# Altium schematic sheet SCH_DONGHO.SchDoc
size A3; SheetNumber: 5; SheetTotal: 5
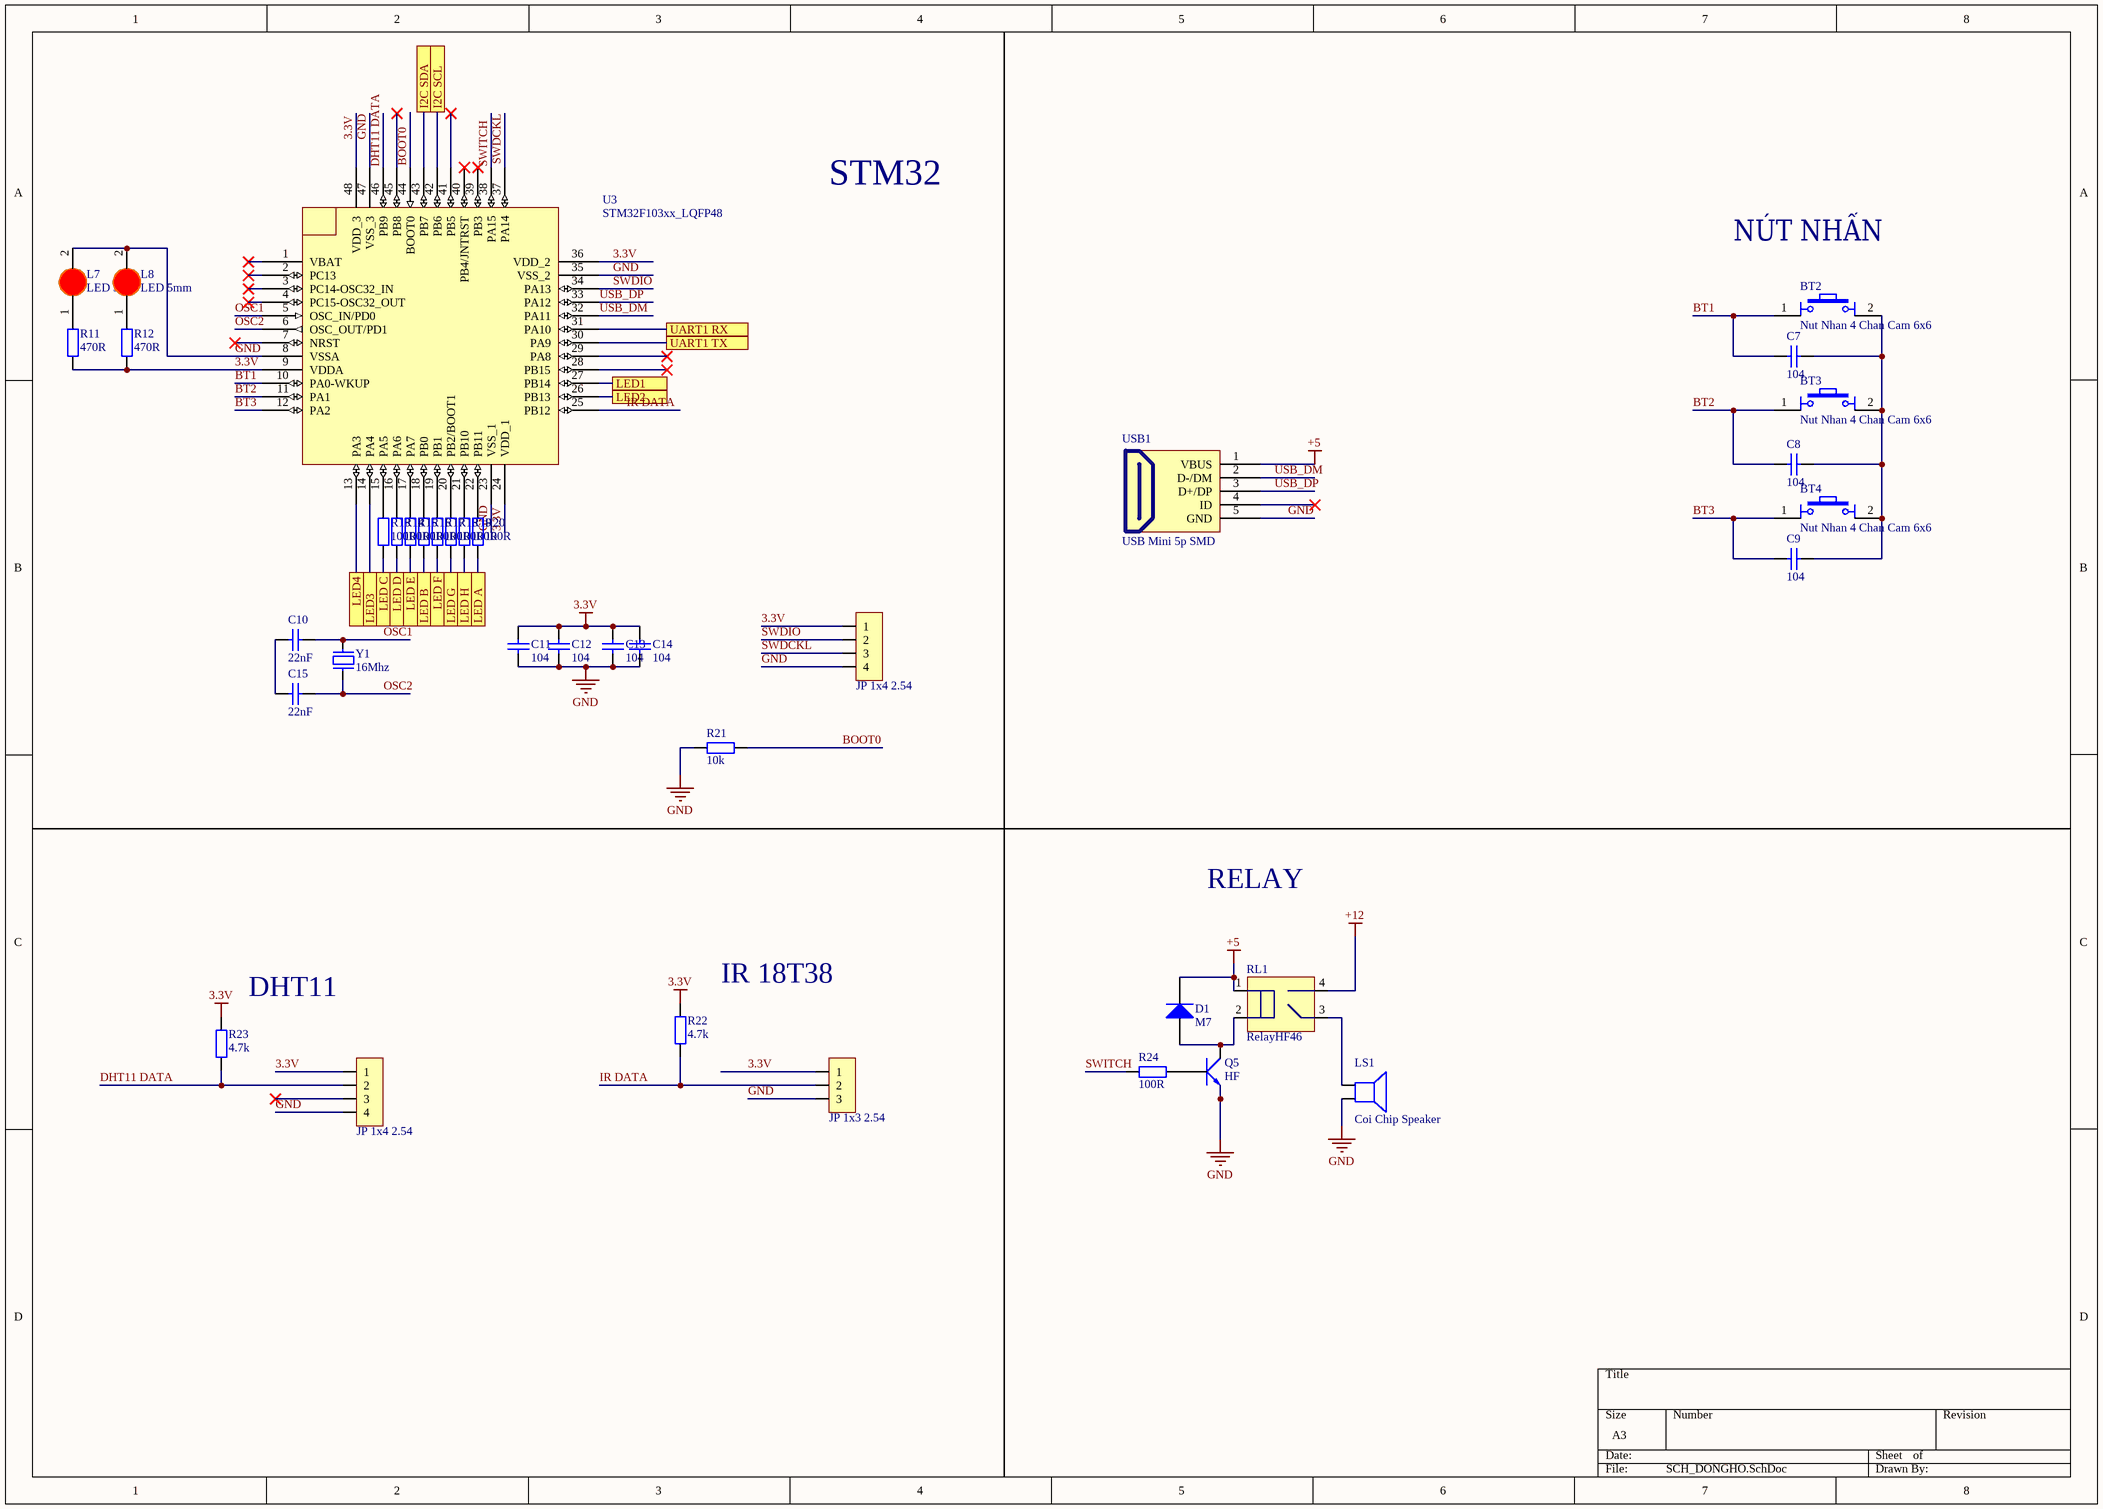
[diagram p0: SCH_DONGHO.SchDoc]

## Parts
BT2  Nut Nhan 4 Chan Cam 6x6  [Nut Nhan 4 Chan Cam 6x6]
BT3  Nut Nhan 4 Chan Cam 6x6  [Nut Nhan 4 Chan Cam 6x6]
BT4  Nut Nhan 4 Chan Cam 6x6  [Nut Nhan 4 Chan Cam 6x6]
C7  104  [tu 0805]
C8  104  [tu 0805]
C9  104  [tu 0805]
C10  22nF  [tu 0805]
C11  104  [tu 0805]
C12  104  [tu 0805]
C13  104  [tu 0805]
C14  104  [tu 0805]
C15  22nF  [tu 0805]
D1  M7  [DIODE SMA]
JP1  JP 1x4 2.54  [JP 1x4 CT]
JP2  JP 1x4 2.54  [JP 1x4 CT]
JP3  JP 1x3 2.54  [JP 1x3 CT]
L7  LED 5mm  [LED-5MM-RED]
L8  LED 5mm  [LED-5MM-RED]
LS1  Coi Chip Speaker  [Coi Chip Speacker]
Q5  HF  [SOT23]
R11  470R  [Tro SMD 0805]
R12  470R  [Tro SMD 0805]
R13  100R  [tro smd 0805]
R14  100R  [tro smd 0805]
R15  100R  [tro smd 0805]
R16  100R  [tro smd 0805]
R17  100R  [tro smd 0805]
R18  100R  [tro smd 0805]
R19  100R  [tro smd 0805]
R20  100R  [tro smd 0805]
R21  10k  [tro smd 0805]
R22  4.7k  [tro smd 0805]
R23  4.7k  [tro smd 0805]
R24  100R  [tro smd 0805]
RL1  RelayHF46  [Relay 4 chan HF46F]
U3  STM32F103xx_LQFP48  [STM32_LQPF48]
USB1  USB Mini 5p SMD  [USB Mini 5p SMD]
Y1  16Mhz  [Thach Anh 2 chan SMD]

## Ports
I2C SCL, I2C SDA, LED1, LED2, LED3, LED4, LED A, LED B, LED C, LED D, LED E, LED F, LED G, LED H, UART1 RX, UART1 TX

## Nets
3.3V: C11.1 C12.1 C13.1 C14.1 JP1.1 JP2.1 JP3.1 R11.1 R12.1 R22.2 R23.2 U3.9(VDDA) U3.24(VDD_1) U3.36(VDD_2) U3.48(VDD_3)
+5: D1.2(K) RL1.1 USB1.1(VBUS)
+12: RL1.4(AC/DC)
GND: C11.2 C12.2 C13.2 C14.2 JP1.4 JP2.4 JP3.3 L7.2(K) L8.2(K) LS1.2 Q5.2(E) R21.2 U3.8(VSSA) U3.23(VSS_1) U3.35(VSS_2) U3.47(VSS_3) USB1.5(GND)
BOOT0: R21.1 U3.44(BOOT0)
BT1: BT2.1 C7.2 U3.10(PA0-WKUP)
BT2: BT3.1 C8.2 U3.11(PA1)
BT3: BT4.1 C9.2 U3.12(PA2)
DHT11 DATA: JP2.2 R23.1 U3.46(PB9)
I2C SCL: U3.42(PB6) ; port I2C SCL
I2C SDA: U3.43(PB7) ; port I2C SDA
IR DATA: JP3.2 R22.1 U3.25(PB12)
LED1: U3.27(PB14) ; port LED1
LED2: U3.26(PB13) ; port LED2
LED3: U3.14(PA4) ; port LED3
LED4: U3.13(PA3) ; port LED4
LED A: R20.2 ; port LED A
LED B: R16.2 ; port LED B
LED C: R13.1 ; port LED C
LED D: R14.1 ; port LED D
LED E: R15.1 ; port LED E
LED F: R17.1 ; port LED F
LED G: R18.2 ; port LED G
LED H: R19.2 ; port LED H
OSC1: C10.1 U3.5(OSC_IN/PD0) Y1.2
OSC2: C15.1 U3.6(OSC_OUT/PD1) Y1.1
SWDCKL: JP1.3 U3.37(PA14)
SWDIO: JP1.2 U3.34(PA13)
SWITCH: R24.1 U3.38(PA15)
UART1 RX: U3.31(PA10) ; port UART1 RX
UART1 TX: U3.30(PA9) ; port UART1 TX
USB_DM: U3.32(PA11) USB1.2(D-/DM)
USB_DP: U3.33(PA12) USB1.3(D+/DP)
NetBT2_2: BT2.2 BT3.2 BT4.2 C7.1 C8.1 C9.1
NetC10_2: C10.2 C15.2
NetD1_1: D1.1(A) Q5.3(C) RL1.2
NetL7_1: L7.1(A) R11.2
NetL8_1: L8.1(A) R12.2
NetLS1_1: LS1.1 RL1.3(AC/DC)
NetQ5_1: Q5.1(B) R24.2
NetR13_2: R13.2 U3.15(PA5)
NetR14_2: R14.2 U3.16(PA6)
NetR15_2: R15.2 U3.17(PA7)
NetR16_1: R16.1 U3.18(PB0)
NetR17_2: R17.2 U3.19(PB1)
NetR18_1: R18.1 U3.20(PB2/BOOT1)
NetR19_1: R19.1 U3.21(PB10)
NetR20_1: R20.1 U3.22(PB11)

Not connected (* = marked no-connect by the designer): JP2 3*; U3 1(VBAT)* 2(PC13)* 3(PC14-OSC32_IN)* 4(PC15-OSC32_OUT)* 7(NRST)* 28(PB15)* 29(PA8)* 39(PB3)* 40(PB4/JNTRST)* 41(PB5)* 45(PB8)*; USB1 4(ID)*

## Notes on the sheet
- STM32
- NÚT NHẤN
- RELAY
- (near R22) IR 18T38
- (near R23) DHT11

## Library data of the parts
BT2-BT4 = Nut Nhan 4 Chan Cam 6x6: Nut Nhan 4 Chan 6x6mm; Ten: Nút Nhấn 4 Chân 6x6x5MM DIP; Ma_Hang: MH004584
C7-C9 C11-C14 = Tu 0805 104 50V 10%: Dán; Don_Vi: Con; So_Chan: 2; Ten_Linh_Kien: Tụ 0805 104-100nF 10% 50V; Ma_Hang: MH004551; Chung_Loai: Dán; Kieu_Chan: *
C10 C15 = Tu 0805 22nF 50V 20%: Dán; Don_Vi: Con; So_Chan: 2; Ten_Linh_Kien: Tụ 0805 22nF 50V 20%; Ma_Hang: MH007857; Chung_Loai: Dán; Kieu_Chan: *
D1 = Diode M7 ( 4007 ): Dán; Don_Vi: Con; Ten_Linh_Kien: Diode M7 1N4007 SMD 1A 1000V; Ma_Hang: MH000944; Chung_Loai: Dán; Ghi_Chu: *
JP1 JP2 = JP 1x4 2.54 Cai Thang: Cắm; Ten_Linh_Kien: Jump Đơn Cái 2.54MM 1x20P Thẳng; Don_Vi: Con; Ma_Hang: MH004006; Ghi_Chu: *; Kieu_Chan: *; Chung_Loai: Cắm
JP3 = JP 1x3 2.54 Cai Thang: Cắm; Ten_Linh_Kien: Jump Đơn Cái 2.54MM 1x20P Thẳng; Don_Vi: Con; Ma_Hang: MH004006; Ghi_Chu: *; Kieu_Chan: *; Chung_Loai: Cắm
L7 L8 = LED 5mm Do: Cắm; Don_Vi: Con; Ma_Hang: MH008967; Ten_Linh_Kien: Led 5MM Phủ Đỏ (1000c); Ghi_Chu: *; Kieu_Chan: *; Chung_Loai: Cắm
LS1 = Coi Chip Speaker: Còi chip
Q5 = C1815 HF SMD: NPN transistor; Value: C9014
R11 R12 = Tro 0805 5% 470R: Dán; Don_Vi: Con; Ma_Hang: MH005341; Ten_Linh_Kien: Trở 0805 5% 470R; So_Chan: 2; Chung_Loai: Dán; Kieu_Chan: *
R13-R20 R24 = Tro 0805 5% 100R: Dán; Don_Vi: Con; So_Chan: 2; Ten_Linh_Kien: Trở 0805 5% 100R; Ma_Hang: MH005251; Chung_Loai: Dán; Kieu_Chan: *
R21 = Tro 0805 5% 10k: Dán; Don_Vi: Con; So_Chan: 2; Ten_Linh_Kien: Trở 0805 5% 10k; Ma_Hang: MH005239; Chung_Loai: Dán; Kieu_Chan: *
R22 R23 = Tro 0805 5% 4.7k: Dán; Don_Vi: Con; So_Chan: 2; Ten_Linh_Kien: Trở 0805 5% 4.7k; Ma_Hang: MH005307; Chung_Loai: Dán; Kieu_Chan: *
RL1 = Relay 4 chan HF46F: Ten: Relay 5V5A HF46F-G 5-HS1; Ma_Hang: MH003879
USB1 = USB Mini 5p SMD: USB Type B; Ten: MiniUSB 5P SMD; Ma_Hang: MH001022
Y1 = Thach Anh 2 chan SMD: Crystal For all Crystal 2pin.; Value: 4Mhz
U3 = STM32F103xx_LQFP48: Published: 30-May-2008; DatasheetVersion: rev6, Mar-2008; PackageVersion: Mar-2008; PackageReference: LQFP48; Publisher: Altium Limited; PackageDescription: 48-Pin Low-Profile Quad Flat Pack, 7 x 7 mm Body, 0.5 mm Pitch (LQFP48); ComponentLink1Description: Manufacturer Link; ComponentLink1URL: www.st.com/stm32; ComponentLink2Description: Datasheet; ComponentLink2URL: http://www.st.com/stonline/products/literature/ds/13587.pdf